# EAGLE schematic Alimv0 (EAGLE 9.0.0)
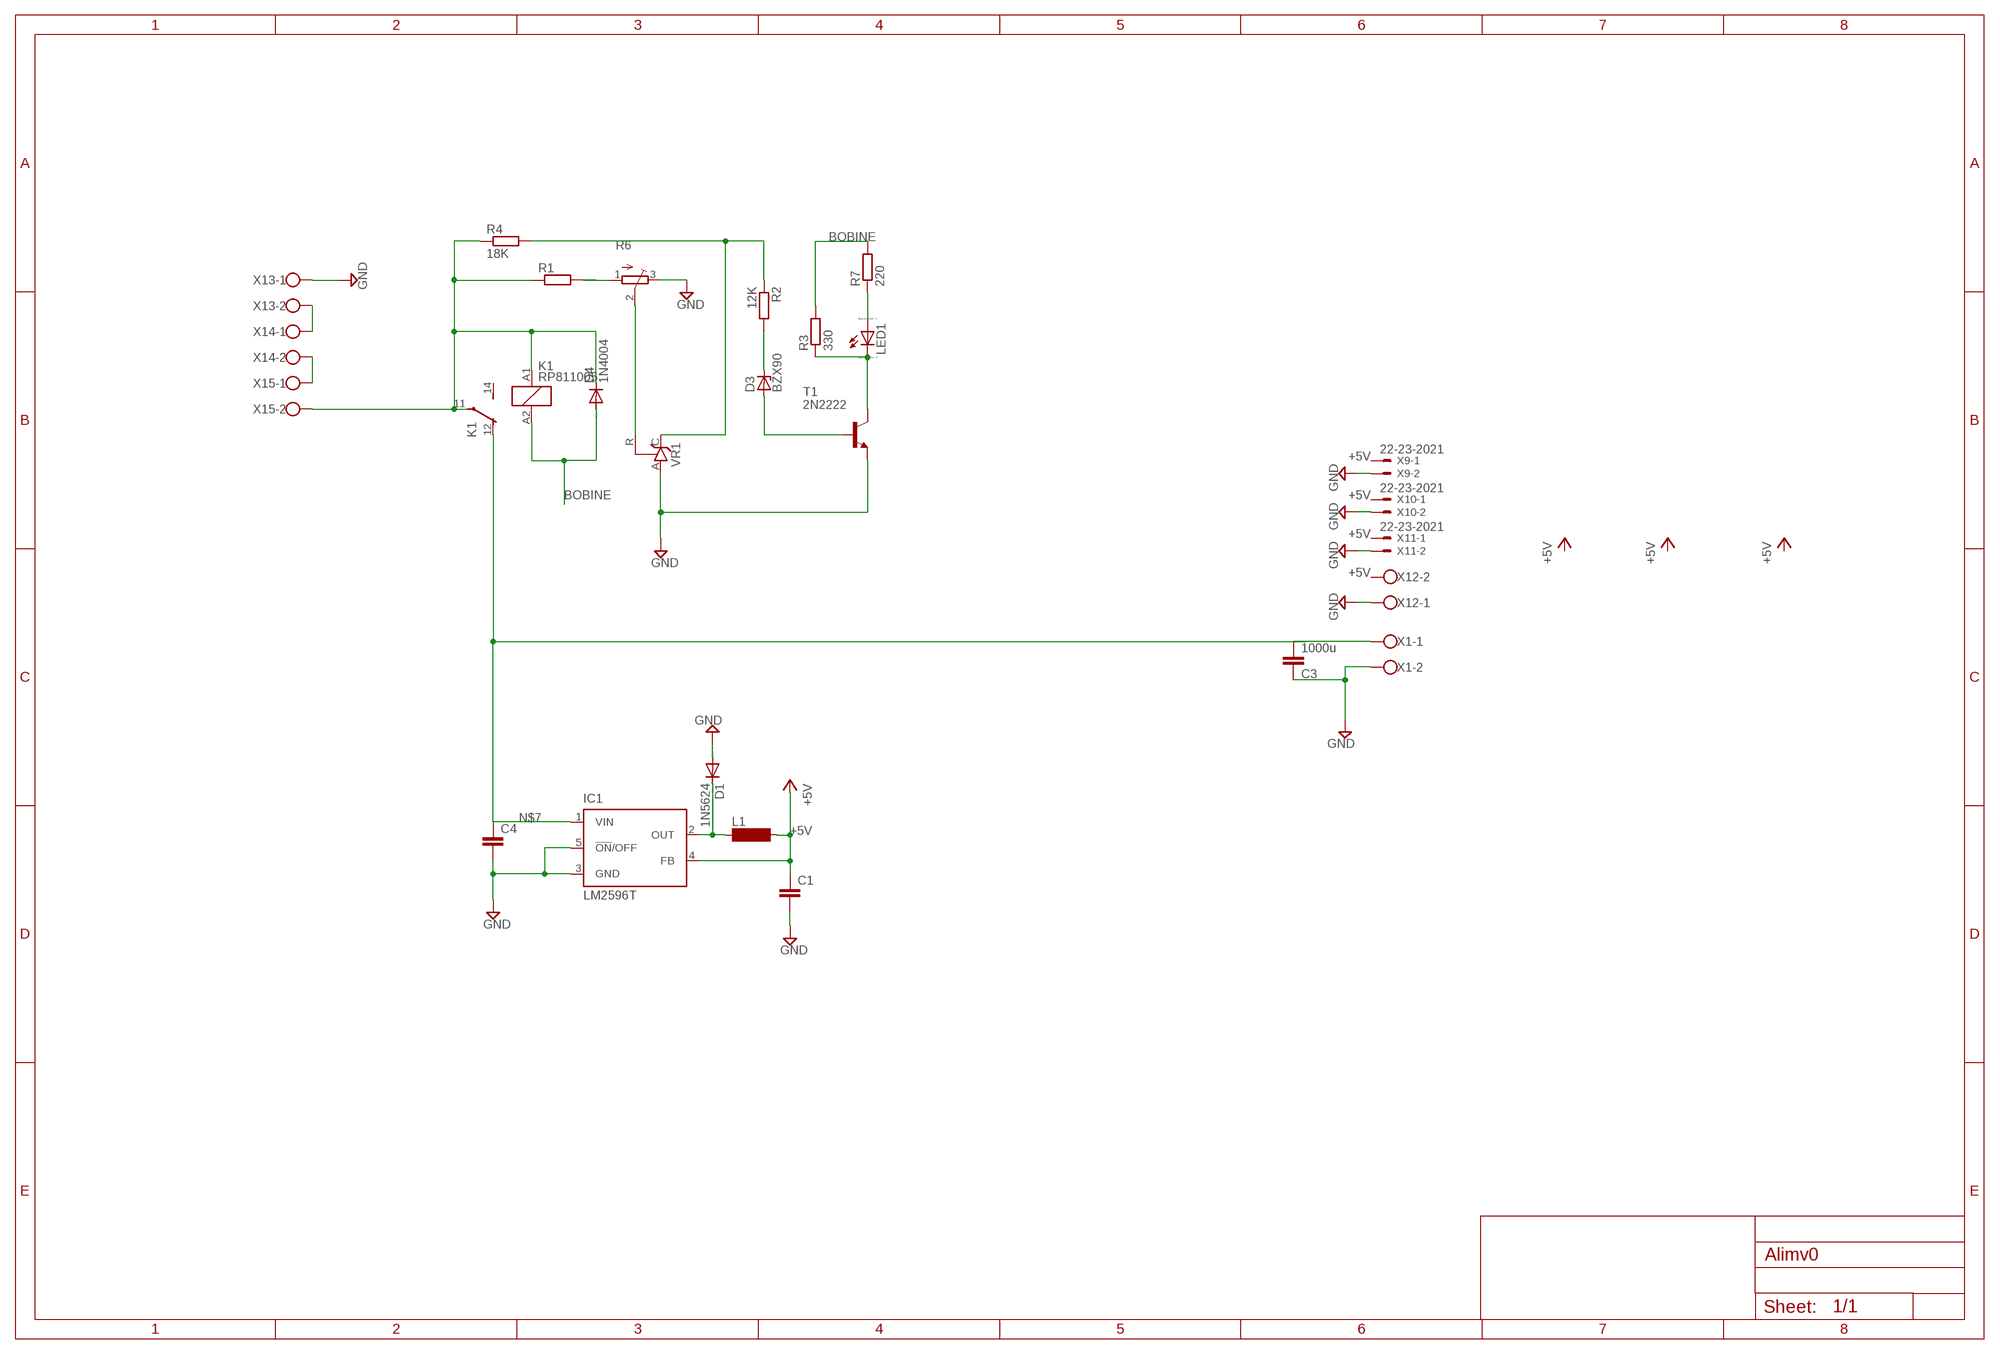
[diagram p0: schematic, sheet 1]

## Parts
C1  C-EUC0603  [C0603]
C3  1000u  C-EUC0603  [C0603]
C4  C-EUC0603  [C0603]
D1  1N5624  [DO201-15]
D3  BZX90  [DO34Z7]
D4  1N4004  [DO41-10]
IC1  LM2596T  [T05D]
K1  RP811005  [RT-C/O12A5]
L1  SM-L15A  [SM-L15A]
LED1  LED_E  [LED_1206]
R1  R-EU_R0805  [R0805]
R2  12K  R-EU_R0805  [R0805]
R3  330  R-EU_R0805  [R0805]
R4  18K  R-EU_R0805  [R0805]
R6  TRIM_EU-3223G  [3223G]
R7  220  R-EU_R0805  [R0805]
T1  2N2222  [TO18]
VR1  TL431CLP  [TO92-CLP]
X1  W237-102  [W237-102]
X9  22-23-2021  [22-23-2021]
X10  22-23-2021  [22-23-2021]
X11  22-23-2021  [22-23-2021]
X12  W237-102  [W237-102]
X13  W237-102  [W237-102]
X14  W237-102  [W237-102]
X15  W237-102  [W237-102]

## Nets
+5V: C1.1 IC1.4(FB) L1.2
BOB: D4.C K1.11(2:P) K1.A1 R1.1 R4.1 X15.2
BOBINE: D4.A K1.A2 R3.2 R7.2
GND: C1.2 C3.1 C4.2 D1.A IC1.3(GND) IC1.5(!ON!/OFF) R6.3(E) T1.1(E) VR1.A X1.2 X9.2 X10.2 X11.2 X12.1
N$1: X13.1 ; supply symbol labelled GND
N$3: X13.2 X14.1
N$4: X14.2 X15.1
N$5: R1.2 R6.1(A)
N$7: C4.1 IC1.1(VIN)
N$8: D3.C R2.2
N$10: D3.A T1.2(B)
N$11: K1.12(2:O)
N$12: D1.C IC1.2(OUT) L1.1
N$13: C3.2 X1.1
N$14: LED1.A R7.1
N$15: R6.2(S) VR1.R
N$21: LED1.C R3.1 T1.3(C)
N$22: R2.1 R4.2 VR1.C
Unconnected: K1.14(2:S) X9.1 X10.1 X11.1 X12.2

## Library data of the parts
C1 C3 C4 = resistor:C-EU: CAPACITOR, European symbol
D1 = diode:1N5624: DIODE controlled avalanche rectifier
D3 = diode:BZX90: Z DIODE
D4 = diode:1N4004: DIODE general purpose rectifier, 1 A
IC1 = national-semiconductor:LM2596: SIMPLE SWITCHER® Power Converter 150 kHz 3A Step-Down Voltage Regulator Source: http://www.national.com/ds/LM/LM2596.pdf; MPN: LM2596T-ADJ/LF02; OC_FARNELL: 9494162; OC_NEWARK: 65K5910
K1 = relay:RP?11*: Power PCB Relay RP II/1 SCHRACK 1 pole 8 / 12 A Source: http://www.schrack.com/.. 5834.pdf; OC_FARNELL: unknown; OC_NEWARK: unknown
L1 = inductor-neosid:SM-L15: INDUCTOR SMD air coil with pick and place cap; OC_FARNELL: unknown; OC_NEWARK: unknown
LED1 = eagle-ltspice:LED_E: LED Source: http://www.osram.convergy.de Source: www.luxeon.com Source: www.kingbright.com; SPICEMODEL: NONE; SPICEPREFIX: D; SPICETYPE: diode
R1-R4 R7 = resistor:R-EU_: RESISTOR, European symbol
R6 = pot:TRIM_EU-: POTENTIOMETER
T1 = transistor:2N2222: NPN TRANSISTOR
VR1 = v-reg:TL431CLP: VOLTAGE REGULATOR
X1 X12-X15 = con-wago-500:W237-102: WAGO SCREW CLAMP; MPN: 237-102; OC_FARNELL: unknown; OC_NEWARK: 70K9898
X9-X11 = con-molex:22-23-2021: .100" (2.54mm) Center Header - 2 Pin; MF: MOLEX; MPN: 22-23-2021; OC_FARNELL: 1462926; OC_NEWARK: 25C3832